# EAGLE schematic HAUPTPCB (EAGLE 7.1.0)
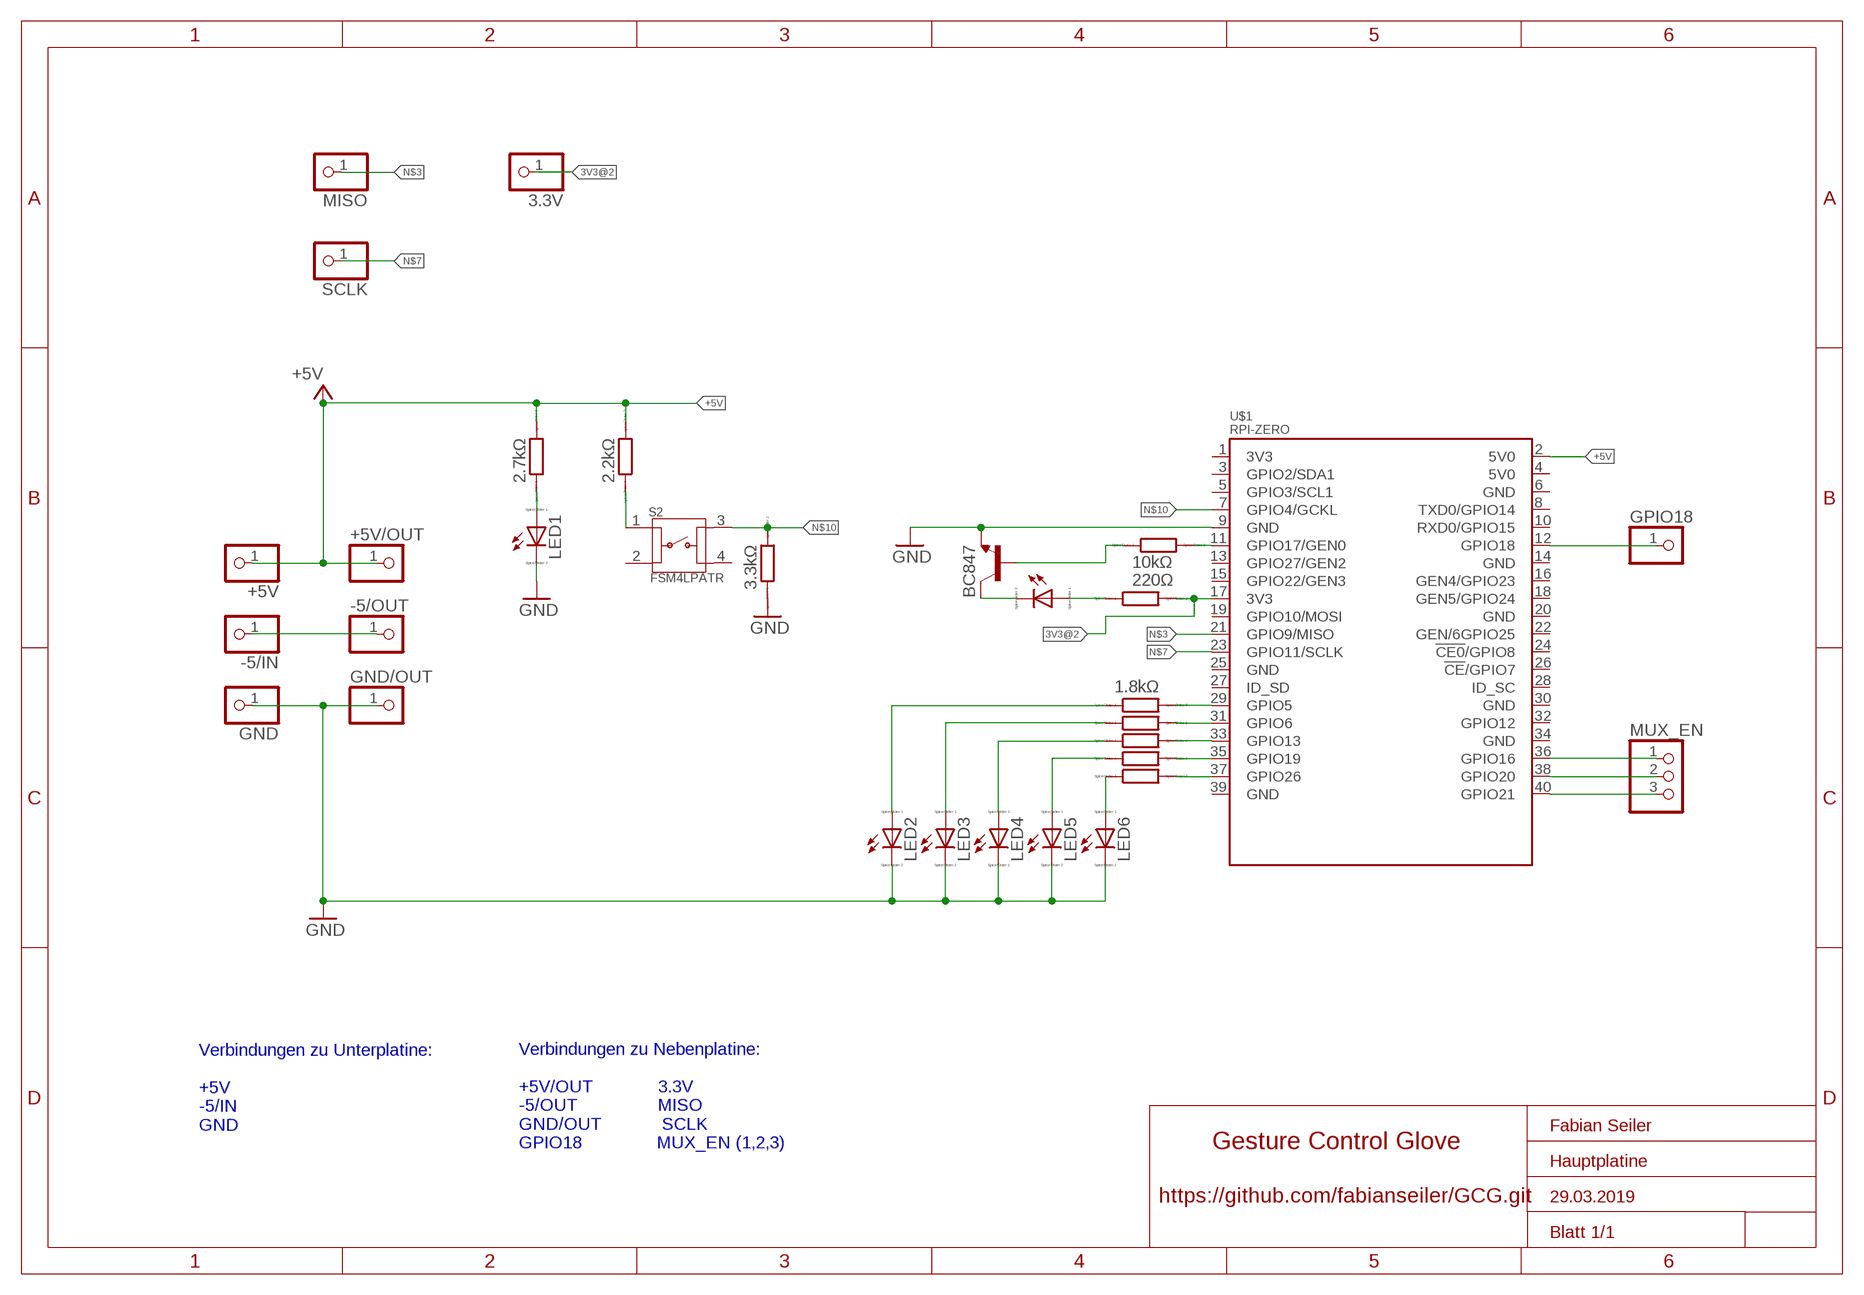
[diagram p0: schematic, sheet 1]

## Parts
3.3V  PINHD-1X1CB  [1X01-CLEANBIG]
+5V  PINHD-1X1CB  [1X01-CLEANBIG]
+5V/OUT  PINHD-1X1CB  [1X01-CLEANBIG]
-5/IN  PINHD-1X1CB  [1X01-CLEANBIG]
-5/OUT  PINHD-1X1CB  [1X01-CLEANBIG]
GND  PINHD-1X1CB  [1X01-CLEANBIG]
GND/OUT  PINHD-1X1CB  [1X01-CLEANBIG]
GPIO18  PINHD-1X1CB  [1X01-CLEANBIG]
LED1  LED_ESML0603  [LED_SML0603]
LED2  LED_ESML0603  [LED_SML0603]
LED3  LED_ESML0603  [LED_SML0603]
LED4  LED_ESML0603  [LED_SML0603]
LED5  LED_ESML0603  [LED_SML0603]
LED6  LED_ESML0603  [LED_SML0603]
LED_IR  LED_ELD260  [LED_LD260]
MISO  PINHD-1X1CB  [1X01-CLEANBIG]
MUX_EN  PINHD-1X3CB  [1X03-CLEANBIG]
R_IR1  10kΩ  R-EU_R0402  [R0402]
R_IR2  220Ω  R-EU_R0402  [R0402]
R_TTP1  2.7kΩ  R-EU_R0402  [R0402]
R_TTP9  2.2kΩ  R-EU_R0402  [R0402]
R_TTP10  3.3kΩ  R-EU_R0402  [R0402]
RL1  1.8kΩ  R-EU_R0402  [R0402]
RL2  R-EU_R0402  [R0402]
RL3  R-EU_R0402  [R0402]
RL4  R-EU_R0402  [R0402]
RL5  R-EU_R0402  [R0402]
S2  FSM4LPATR  [SW_FSM4LPATR]
SCLK  PINHD-1X1CB  [1X01-CLEANBIG]
T1  BC847  [SOT23]
U$1  RPI-ZERO  [RASPBERRYPI_BASTELSTUBE_V13_RASPI_BOARD_B+_FULL]

## Nets
3V3@2: 3.3V.1 R_IR2.2 U$1.17(3V3)
+5V: +5V.1 +5V/OUT.1 R_TTP1.2 R_TTP9.2 U$1.2(5V0)
GND: GND.1 GND/OUT.1 LED1.C LED2.C LED3.C LED4.C LED5.C LED6.C R_TTP10.1 T1.2(E) U$1.9(GND)
N$1: -5/IN.1 -5/OUT.1
N$2: LED_IR.K(C) T1.3(C)
N$3: MISO.1 U$1.21(GPIO9/MISO)
N$4: MUX_EN.3 U$1.40(GPIO21)
N$5: R_IR1.2 U$1.11(GPIO17/GEN0)
N$6: LED1.A R_TTP1.1
N$7: SCLK.1 U$1.23(GPIO11/SCLK)
N$9: LED_IR.A R_IR2.1
N$10: R_TTP10.2 S2.3 U$1.7(GPIO4/GCKL)
N$13: LED5.A RL4.1
N$16: LED4.A RL3.1
N$17: LED6.A RL5.1
N$18: LED3.A RL2.1
N$19: LED2.A RL1.1
N$24: MUX_EN.2 U$1.38(GPIO20)
N$25: MUX_EN.1 U$1.36(GPIO16)
N$26: GPIO18.1 U$1.12(GPIO18)
N$35: RL5.2 U$1.37(GPIO26)
N$36: RL4.2 U$1.35(GPIO19)
N$37: RL3.2 U$1.33(GPIO13)
N$38: RL1.2 U$1.29(GPIO5)
N$39: RL2.2 U$1.31(GPIO6)
N$47: R_IR1.1 T1.1(B)
N$66: R_TTP9.1 S2.1
Unconnected: S2.2 S2.4 U$1.1(3V3) U$1.3(GPIO2/SDA1) U$1.4(5V0) U$1.5(GPIO3/SCL1) U$1.6(GND) U$1.8(TXD0/GPIO14) U$1.10(RXD0/GPIO15) U$1.13(GPIO27/GEN2) U$1.14(GND) U$1.15(GPIO22/GEN3) U$1.16(GEN4/GPIO23) U$1.18(GEN5/GPIO24) U$1.19(GPIO10/MOSI) U$1.20(GND) U$1.22(GEN/6GPIO25) U$1.24(!CE0!/GPIO8) U$1.25(GND) U$1.26(!CE!/GPIO7) U$1.27(ID_SD) U$1.28(ID_SC) U$1.30(GND) U$1.32(GPIO12) U$1.34(GND) U$1.39(GND)

## Notes on the sheet
- Fabian Seiler
- Verbindungen zu Unterplatine:
  
  +5V
  -5/IN
  GND
- Gesture Control Glove
- Verbindungen zu Nebenplatine:
  
  +5V/OUT             3.3V
  -5/OUT                MISO
  GND/OUT            SCLK
  GPIO18               MUX_EN (1,2,3)
- Hauptplatine
- https://github.com/fabianseiler/GCG.git | 29.03.2019
- Blatt 1/1

## Library data of the parts
3.3V +5V +5V/OUT -5/IN -5/OUT GND GND/OUT GPIO18 MISO SCLK = adafruit:PINHD-1X1: Pin header 1x1 for 0.1" spacing With round pins
LED1-LED6 LED_IR = eagle-ltspice:LED_E: LED Source: http://www.osram.convergy.de Source: www.luxeon.com Source: www.kingbright.com; SPICEMODEL: NONE; SPICEPREFIX: D; SPICETYPE: diode
MUX_EN = adafruit:PINHD-1X3: PIN HEADER
R_IR1 R_IR2 R_TTP1 R_TTP9 R_TTP10 RL1-RL5 = resistor:R-EU_: RESISTOR, European symbol; SPICEPREFIX: R
S2 = FSM4LPATR:FSM4LPATR: Switch Tactile OFF (ON) SPST Round Button Gull Wing 0.05A 24VDC 2.55N SMD Loose; AVAILABILITY: Unavailable; DESCRIPTION: Switch Tactile OFF _ON_ SPST Round Button Gull Wing 0.05A 24VDC 2.55N SMD Loose; MF: TE Connectivity / Alcoswitch; MP: FSM4LPATR; PACKAGE: None; PRICE: None; TE_PURCHASE_URL: https://www.te.com/usa-en/product-FSM4LPATR.html?te_bu=Cor&te_type=disp&te_campaign=seda_glo_cor-seda-global-disp-prtnr-fy19-seda-model-bom-cta_sma-317_1&elqCampaignId=32493
T1 = transistor:BC847: NPN TRANSISTOR
U$1 = RPI-Zero:RPI-ZERO